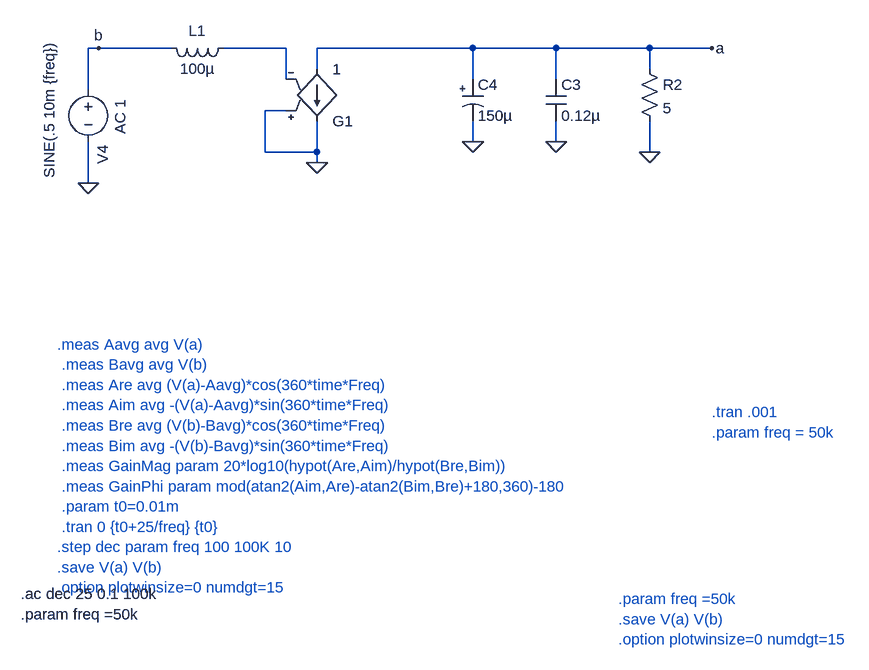
[diagram p0: schematic CL_boost_current_mode_power_stage_lin.asc]
CL_boost_current_mode_power_stage_lin.asc, the LTspice schematic file:
Version 4
SHEET 1 1516 1320
WIRE 224 288 208 288
WIRE 336 288 224 288
WIRE 512 288 416 288
WIRE 800 288 560 288
WIRE 928 288 800 288
WIRE 1072 288 928 288
WIRE 1168 288 1072 288
WIRE 560 320 560 288
WIRE 1072 320 1072 288
WIRE 512 336 512 288
WIRE 800 336 800 288
WIRE 928 336 928 288
WIRE 208 352 208 288
WIRE 512 384 480 384
WIRE 800 432 800 400
WIRE 928 432 928 400
WIRE 480 448 480 384
WIRE 560 448 560 400
WIRE 560 448 480 448
WIRE 1072 448 1072 400
WIRE 560 464 560 448
WIRE 208 496 208 432
FLAG 928 432 0
FLAG 800 432 0
FLAG 1072 448 0
FLAG 1168 288 a
FLAG 208 496 0
FLAG 224 288 b
FLAG 560 464 0
SYMBOL voltage 208 336 R0
WINDOW 0 22 101 VRight 2
WINDOW 3 -60 -59 VRight 2
WINDOW 123 49 31 VRight 2
WINDOW 39 0 0 Left 0
SYMATTR InstName V4
SYMATTR Value SINE(.5 10m {freq})
SYMATTR Value2 AC 1
SYMBOL cap 912 336 R0
SYMATTR InstName C3
SYMATTR Value 0.12µ
SYMATTR SpiceLine V=25 Irms=1.56 Rser=0.065176 Lser=0 mfg="KEMET" pn="C1210C124K3RAC" type="X7R"
SYMBOL ind 432 272 R90
WINDOW 0 5 56 VBottom 2
WINDOW 3 32 56 VTop 2
SYMATTR InstName L1
SYMATTR Value 100µ
SYMATTR SpiceLine Ipk=3 Rser=0.2 Rpar=1317 Cpar=2.58p
SYMBOL polcap 784 336 R0
WINDOW 3 24 56 Left 2
SYMATTR Value 150µ
SYMATTR InstName C4
SYMATTR Description Capacitor
SYMATTR Type cap
SYMATTR SpiceLine V=6.3 Irms=0 Rser=0.9 Lser=0 mfg="AVX" pn="TAJD107M006" type="Tantalum"
SYMBOL res 1056 304 R0
SYMATTR InstName R2
SYMATTR Value 5
SYMBOL g 560 416 M180
SYMATTR InstName G1
SYMATTR Value 1
TEXT 160 744 Left 2 ;.meas Aavg avg V(a)\n .meas Bavg avg V(b)\n .meas Are avg (V(a)-Aavg)*cos(360*time*Freq)\n .meas Aim avg -(V(a)-Aavg)*sin(360*time*Freq)\n .meas Bre avg (V(b)-Bavg)*cos(360*time*Freq)\n .meas Bim avg -(V(b)-Bavg)*sin(360*time*Freq)\n .meas GainMag param 20*log10(hypot(Are,Aim)/hypot(Bre,Bim))\n .meas GainPhi param mod(atan2(Aim,Are)-atan2(Bim,Bre)+180,360)-180\n .param t0=0.01m\n .tran 0 {t0+25/freq} {t0}\n.step dec param freq 100 100K 10\n.save V(a) V(b)\n.option plotwinsize=0 numdgt=15
TEXT 104 1128 Left 2 !.ac dec 25 0.1 100k\n.param freq =50k
TEXT 1168 848 Left 2 ;.tran .001\n.param freq = 50k
TEXT 1024 1136 Left 2 ;.param freq =50k\n.save V(a) V(b)\n.option plotwinsize=0 numdgt=15

The netlist it stands for:
* CL_boost_current_mode_power_stage_lin.asc
V4 b 0 SINE(.5 10m {freq}) AC 1
C3 a 0 0.12µ V=25 Irms=1.56 Rser=0.065176 Lser=0 mfg="KEMET" pn="C1210C124K3RAC" type="X7R"
L1 N001 b 100µ Ipk=3 Rser=0.2 Rpar=1317 Cpar=2.58p
C4 a 0 150µ V=6.3 Irms=0 Rser=0.9 Lser=0 mfg="AVX" pn="TAJD107M006" type="Tantalum"
R2 a 0 5
G1 a 0 0 N001 1
* .meas Aavg avg V(a)
*  .meas Bavg avg V(b)
*  .meas Are avg (V(a)-Aavg)*cos(360*time*Freq)
*  .meas Aim avg -(V(a)-Aavg)*sin(360*time*Freq)
*  .meas Bre avg (V(b)-Bavg)*cos(360*time*Freq)
*  .meas Bim avg -(V(b)-Bavg)*sin(360*time*Freq)
*  .meas GainMag param 20*log10(hypot(Are,Aim)/hypot(Bre,Bim))
*  .meas GainPhi param mod(atan2(Aim,Are)-atan2(Bim,Bre)+180,360)-180
*  .param t0=0.01m
*  .tran 0 {t0+25/freq} {t0}
* .step dec param freq 100 100K 10
* .save V(a) V(b)
* .option plotwinsize=0 numdgt=15
.ac dec 25 0.1 100k
.param freq =50k
* .tran .001
* .param freq = 50k
* .param freq =50k
* .save V(a) V(b)
* .option plotwinsize=0 numdgt=15
.backanno
.end